# EAGLE schematic lockShield (EAGLE 5.11)
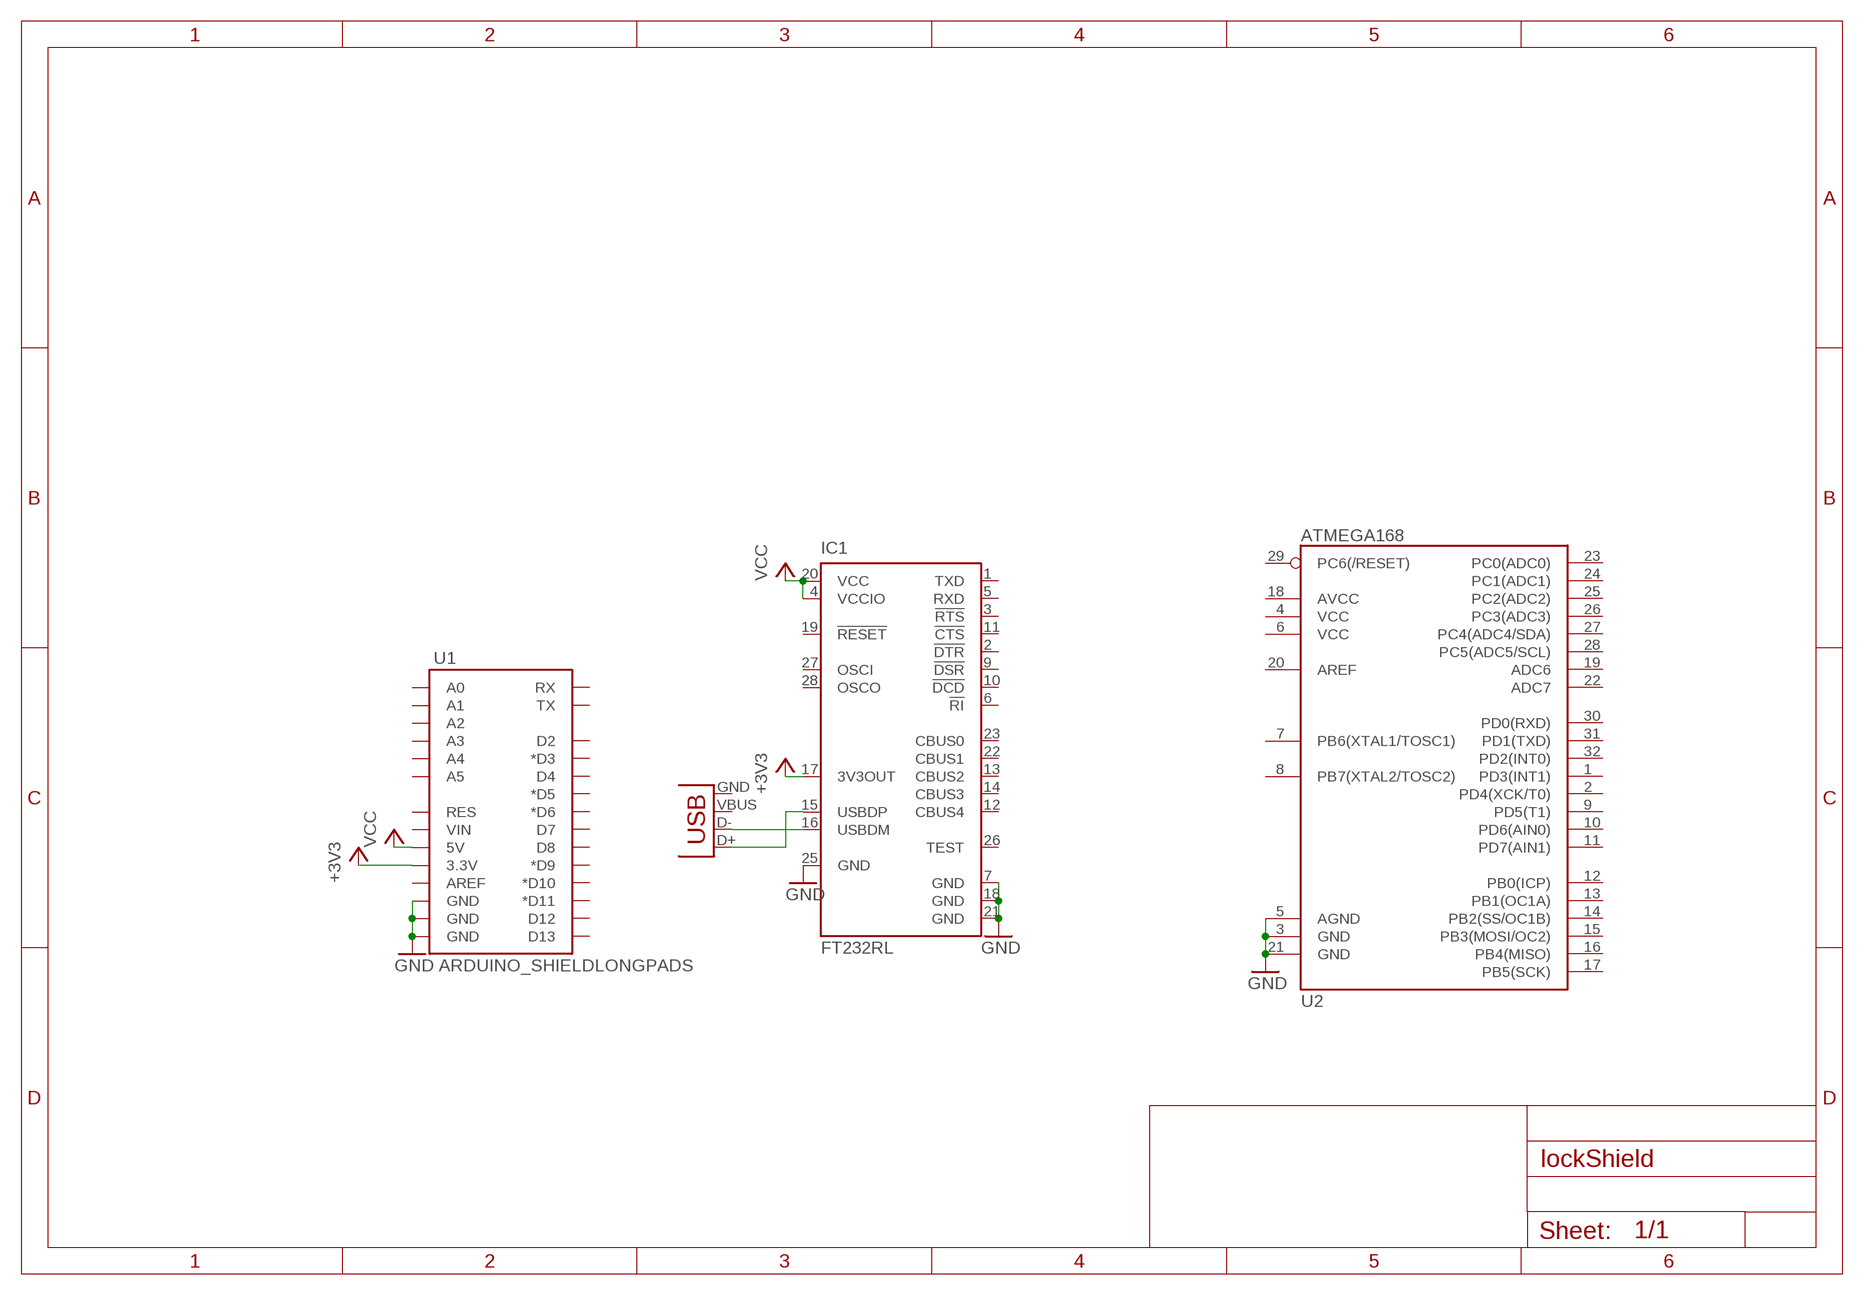
[diagram p0: schematic, sheet 1]

## Parts
IC1  FT232RL  [SSOP28]
U1  ARDUINO_SHIELDLONGPADS  [DUEMILANOVE_SHIELD_LONGPADS]
U2  ATMEGA168  [TQFP32-08]
X1  USB-MB-H  [USB-MB-H]

## Nets
+3V3: IC1.17(3V3OUT) U1.3.3V
GND: IC1.7(GND) IC1.18(GND) IC1.21(GND) IC1.25(GND) U1.GND@0(GND) U1.GND@1(GND) U1.GND@2(GND) U2.3(GND) U2.5(AGND) U2.21(GND)
N$1: IC1.16(USBDM) X1.D-
N$2: IC1.15(USBDP) X1.D+
VCC: IC1.4(VCCIO) IC1.20(VCC) U1.5V
Unconnected: IC1.1(TXD) IC1.2(!DTR) IC1.3(!RTS) IC1.5(RXD) IC1.6(!RI) IC1.9(!DSR) IC1.10(!DCD) IC1.11(!CTS) IC1.12(CBUS4) IC1.13(CBUS2) IC1.14(CBUS3) IC1.19(!RESET) IC1.22(CBUS1) IC1.23(CBUS0) IC1.26(TEST) IC1.27(OSCI) IC1.28(OSCO) U1.A0 U1.A1 U1.A2 U1.A3 U1.A4 U1.A5 U1.AREF U1.D2 U1.D3(*D3) U1.D4 U1.D5(*D5) U1.D6(*D6) U1.D7 U1.D8 U1.D9(*D9) U1.D10(*D10) U1.D11(*D11) U1.D12 U1.D13 U1.RES U1.RX U1.TX U1.VIN U2.1(PD3(INT1)) U2.2(PD4(XCK/T0)) U2.4(VCC) U2.6(VCC) U2.7(PB6(XTAL1/TOSC1)) U2.8(PB7(XTAL2/TOSC2)) U2.9(PD5(T1)) U2.10(PD6(AIN0)) U2.11(PD7(AIN1)) U2.12(PB0(ICP)) U2.13(PB1(OC1A)) U2.14(PB2(SS/OC1B)) U2.15(PB3(MOSI/OC2)) U2.16(PB4(MISO)) U2.17(PB5(SCK)) U2.18(AVCC) U2.19(ADC6) U2.20(AREF) U2.22(ADC7) U2.23(PC0(ADC0)) U2.24(PC1(ADC1)) U2.25(PC2(ADC2)) U2.26(PC3(ADC3)) U2.27(PC4(ADC4/SDA)) U2.28(PC5(ADC5/SCL)) U2.29(PC6(/RESET)) U2.30(PD0(RXD)) U2.31(PD1(TXD)) U2.32(PD2(INT0)) X1.GND X1.VBUS

## Library data of the parts
IC1 = ftdichip:FT232R: Source: http://www.ftdichip.com/Documents/DataSheets/DS_FT232R_v104.pdf; MPN: FT232RL; OC_FARNELL: 1146032; OC_NEWARK: 91K9918
U1 = SparkFun:ARDUINO_SHIELD
U2 = SparkFun:ATMEGA168
X1 = SparkFun:USB: USB Connectors USB-B-PTH is fully proven SKU : PRT-00139 USB-miniB is fully proven SKU : PRT-00587 USB-A-PCB is untested. USB-A-H is throughly reviewed, but untested. Spark Fun Electronics SKU : PRT-00437 USB-B-SMT is throughly reviewed, but untested. Needs silkscreen touching up. USB-A-S has not been used/tested USB-MB-H has not been used/tested